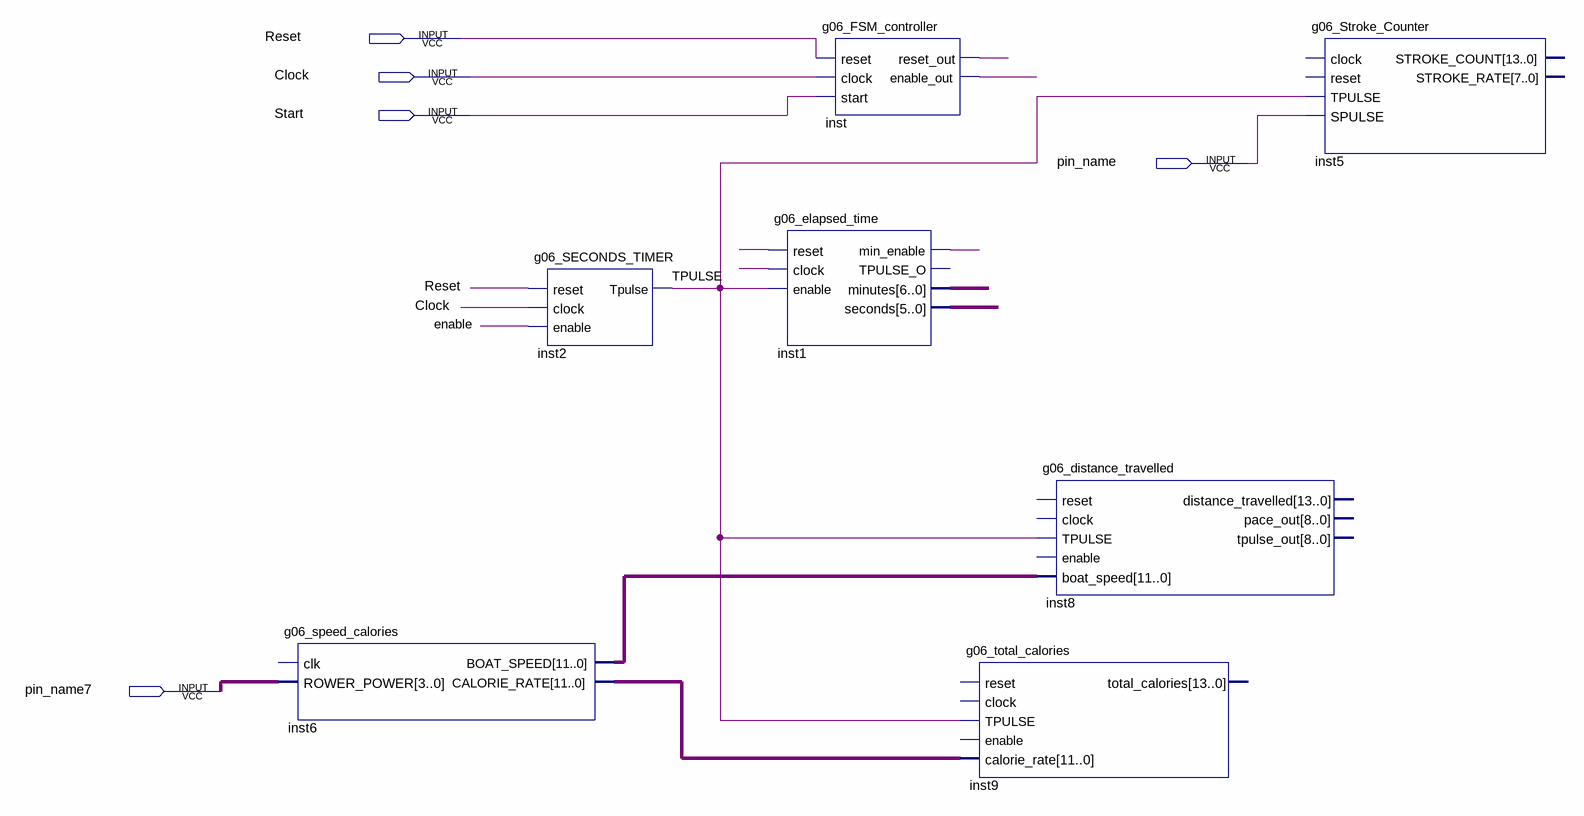
[diagram p0: schematic sheet]
// Quartus schematic g06_Lab5_schematic.bdf as structural Verilog: 7 symbols, 5 pins
module g06_Lab5_schematic (
  input  Reset,
  input  Clock,
  input  Start,
  input  pin_name,
  input  pin_name7
);

  wire enable, inst1_min_enable, inst_enable_out, inst_reset_out, TPULSE, undriven, undriven_2;
  wire [3:0] undriven_3;
  wire [5:0] inst1_seconds;
  wire [6:0] inst1_minutes;
  wire [11:0] inst6_boat_speed, inst6_calorie_rate;

  g06_speed_calories inst6 (
    .ROWER_POWER(undriven_3), .BOAT_SPEED(inst6_boat_speed), .CALORIE_RATE(inst6_calorie_rate));  // open: clk
  g06_SECONDS_TIMER inst2 (.reset(Reset), .clock(Clock), .enable(enable), .Tpulse(TPULSE));
  g06_elapsed_time inst1 (
    .reset(undriven), .clock(undriven_2), .enable(TPULSE), .min_enable(inst1_min_enable),
    .minutes(inst1_minutes), .seconds(inst1_seconds));  // open: TPULSE_O
  g06_FSM_controller inst (
    .reset(Reset), .clock(Clock), .start(Start), .reset_out(inst_reset_out), .enable_out(inst_enable_out));
  g06_total_calories inst9 (
    .TPULSE(TPULSE), .calorie_rate(inst6_calorie_rate));  // open: reset, clock, enable, total_calories
  g06_distance_travelled inst8 (
    .TPULSE(TPULSE), .boat_speed(inst6_boat_speed));  // open: reset, clock, enable, distance_travelled, pace_out, tpulse_out
  g06_Stroke_Counter inst5 (.TPULSE(TPULSE), .SPULSE(pin_name));  // open: clock, reset, STROKE_COUNT, STROKE_RATE
endmodule
